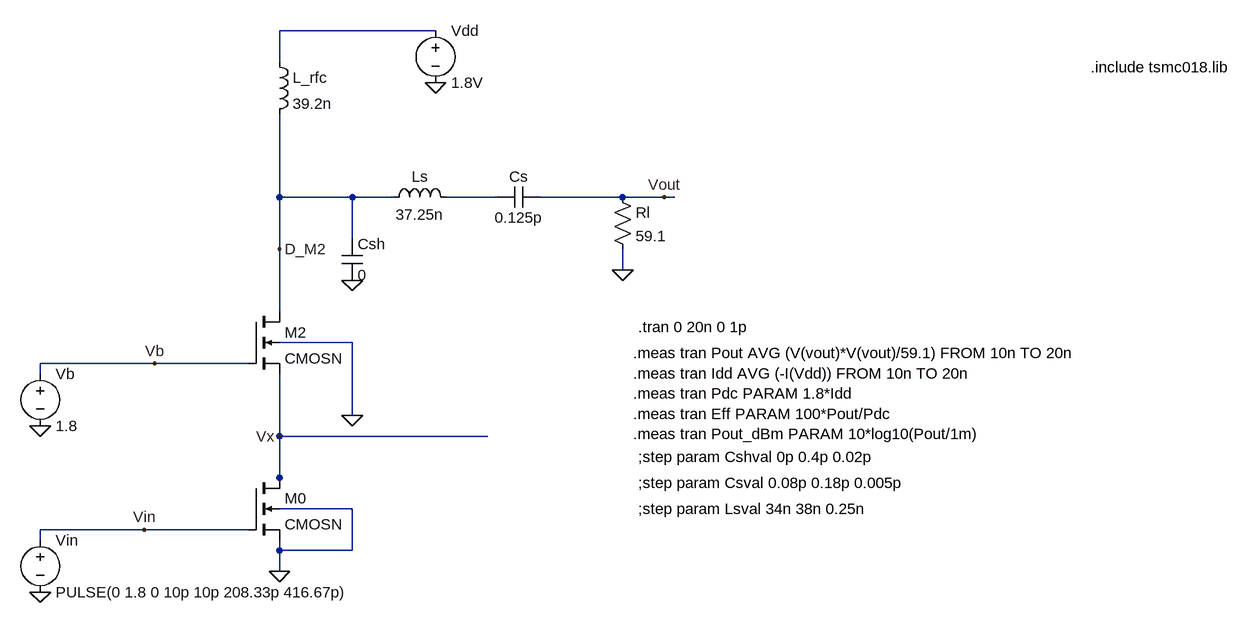
[diagram p0: schematic Conventional_Class_E.asc]
Conventional_Class_E.asc, the LTspice schematic file:
Version 4
SHEET 1 1756 680
WIRE 512 -272 272 -272
WIRE 272 -224 272 -272
WIRE 272 -16 272 -144
WIRE 384 -16 272 -16
WIRE 448 -16 384 -16
WIRE 608 -16 528 -16
WIRE 800 -16 672 -16
WIRE 864 -16 800 -16
WIRE 880 -16 864 -16
WIRE 384 48 384 -16
WIRE 272 64 272 -16
WIRE 800 96 800 64
WIRE 272 160 272 64
WIRE 384 208 272 208
WIRE 80 240 -96 240
WIRE 224 240 80 240
WIRE -96 256 -96 240
WIRE 384 320 384 208
WIRE 272 352 272 256
WIRE 592 352 272 352
WIRE 272 416 272 352
WIRE 272 432 272 416
WIRE 384 464 272 464
WIRE 64 496 -96 496
WIRE 224 496 64 496
WIRE -96 512 -96 496
WIRE 272 528 272 512
WIRE 384 528 384 464
WIRE 384 528 272 528
WIRE 272 560 272 528
FLAG 512 -192 0
FLAG 800 96 0
FLAG 384 320 0
FLAG -96 336 0
FLAG 272 560 0
FLAG -96 592 0
FLAG 80 240 Vb
FLAG 64 496 Vin
FLAG 272 352 Vx
FLAG 864 -16 Vout
FLAG 384 112 0
FLAG 272 64 D_M2
SYMBOL cmosn 224 160 R0
SYMATTR InstName M2
SYMATTR Value2 l=0.18u w=25u m=15
SYMBOL cmosn 224 416 R0
SYMATTR InstName M0
SYMATTR Value2 l=0.18u w=25u m=15
SYMBOL voltage -96 240 R0
SYMATTR InstName Vb
SYMATTR Value 1.8
SYMBOL voltage -96 496 R0
WINDOW 123 0 0 Left 0
WINDOW 39 0 0 Left 0
SYMATTR InstName Vin
SYMATTR Value PULSE(0 1.8 0 10p 10p 208.33p 416.67p)
SYMBOL voltage 512 -288 R0
SYMATTR InstName Vdd
SYMATTR Value 1.8V
SYMBOL ind 256 -240 R0
SYMATTR InstName L_rfc
SYMATTR Value 39.2n
SYMBOL cap 672 -32 R90
WINDOW 0 0 32 VBottom 2
WINDOW 3 32 32 VTop 2
SYMATTR InstName Cs
SYMATTR Value 0.125p
SYMBOL res 784 -32 R0
SYMATTR InstName Rl
SYMATTR Value 59.1
SYMBOL ind 432 0 R270
WINDOW 0 32 56 VTop 2
WINDOW 3 5 56 VBottom 2
SYMATTR InstName Ls
SYMATTR Value 37.25n
SYMBOL cap 368 48 R0
SYMATTR InstName Csh
SYMATTR Value 0
TEXT 1520 -216 Left 2 !.include tsmc018.lib
TEXT 824 184 Left 2 !.tran 0 20n 0 1p
TEXT 816 224 Left 2 !.meas tran Pout AVG (V(vout)*V(vout)/59.1) FROM 10n TO 20n\n.meas tran Idd AVG (-I(Vdd)) FROM 10n TO 20n\n.meas tran Pdc PARAM 1.8*Idd\n.meas tran Eff PARAM 100*Pout/Pdc\n.meas tran Pout_dBm PARAM 10*log10(Pout/1m)
TEXT 824 384 Left 2 !;step param Cshval 0p 0.4p 0.02p
TEXT 824 464 Left 2 !;step param Lsval 34n 38n 0.25n
TEXT 824 424 Left 2 !;step param Csval 0.08p 0.18p 0.005p

The netlist it stands for:
* Conventional_Class_E.asc
M2 D_M2 Vb Vx 0 CMOSN l=0.18u w=25u m=15
M0 Vx Vin 0 0 CMOSN l=0.18u w=25u m=15
Vb Vb 0 1.8
Vin Vin 0 PULSE(0 1.8 0 10p 10p 208.33p 416.67p)
Vdd N001 0 1.8V
L_rfc N001 D_M2 39.2n
Cs Vout N002 0.125p
Rl Vout 0 59.1
Ls D_M2 N002 37.25n
Csh D_M2 0 0
.model NMOS NMOS
.model PMOS PMOS
.lib standard.mos
.include tsmc018.lib
.tran 0 20n 0 1p
.meas tran Pout AVG (V(vout)*V(vout)/59.1) FROM 10n TO 20n
.meas tran Idd AVG (-I(Vdd)) FROM 10n TO 20n
.meas tran Pdc PARAM 1.8*Idd
.meas tran Eff PARAM 100*Pout/Pdc
.meas tran Pout_dBm PARAM 10*log10(Pout/1m)
;step param Cshval 0p 0.4p 0.02p
;step param Lsval 34n 38n 0.25n
;step param Csval 0.08p 0.18p 0.005p
.backanno
.end